# EasyEDA Pro project ProPrj_Crowd Guarddd_2026-06-03.epro

# Schematic Schematic1
Board Name: Board1; Create Date: 2026-06-02; Page Name: P1; Project Name: Crowd Guarddd; Schematic Name: Schematic1; Update Date: 2026-06-02; Company: EasyEDA.com; Page Size: A4; Version: V1.0
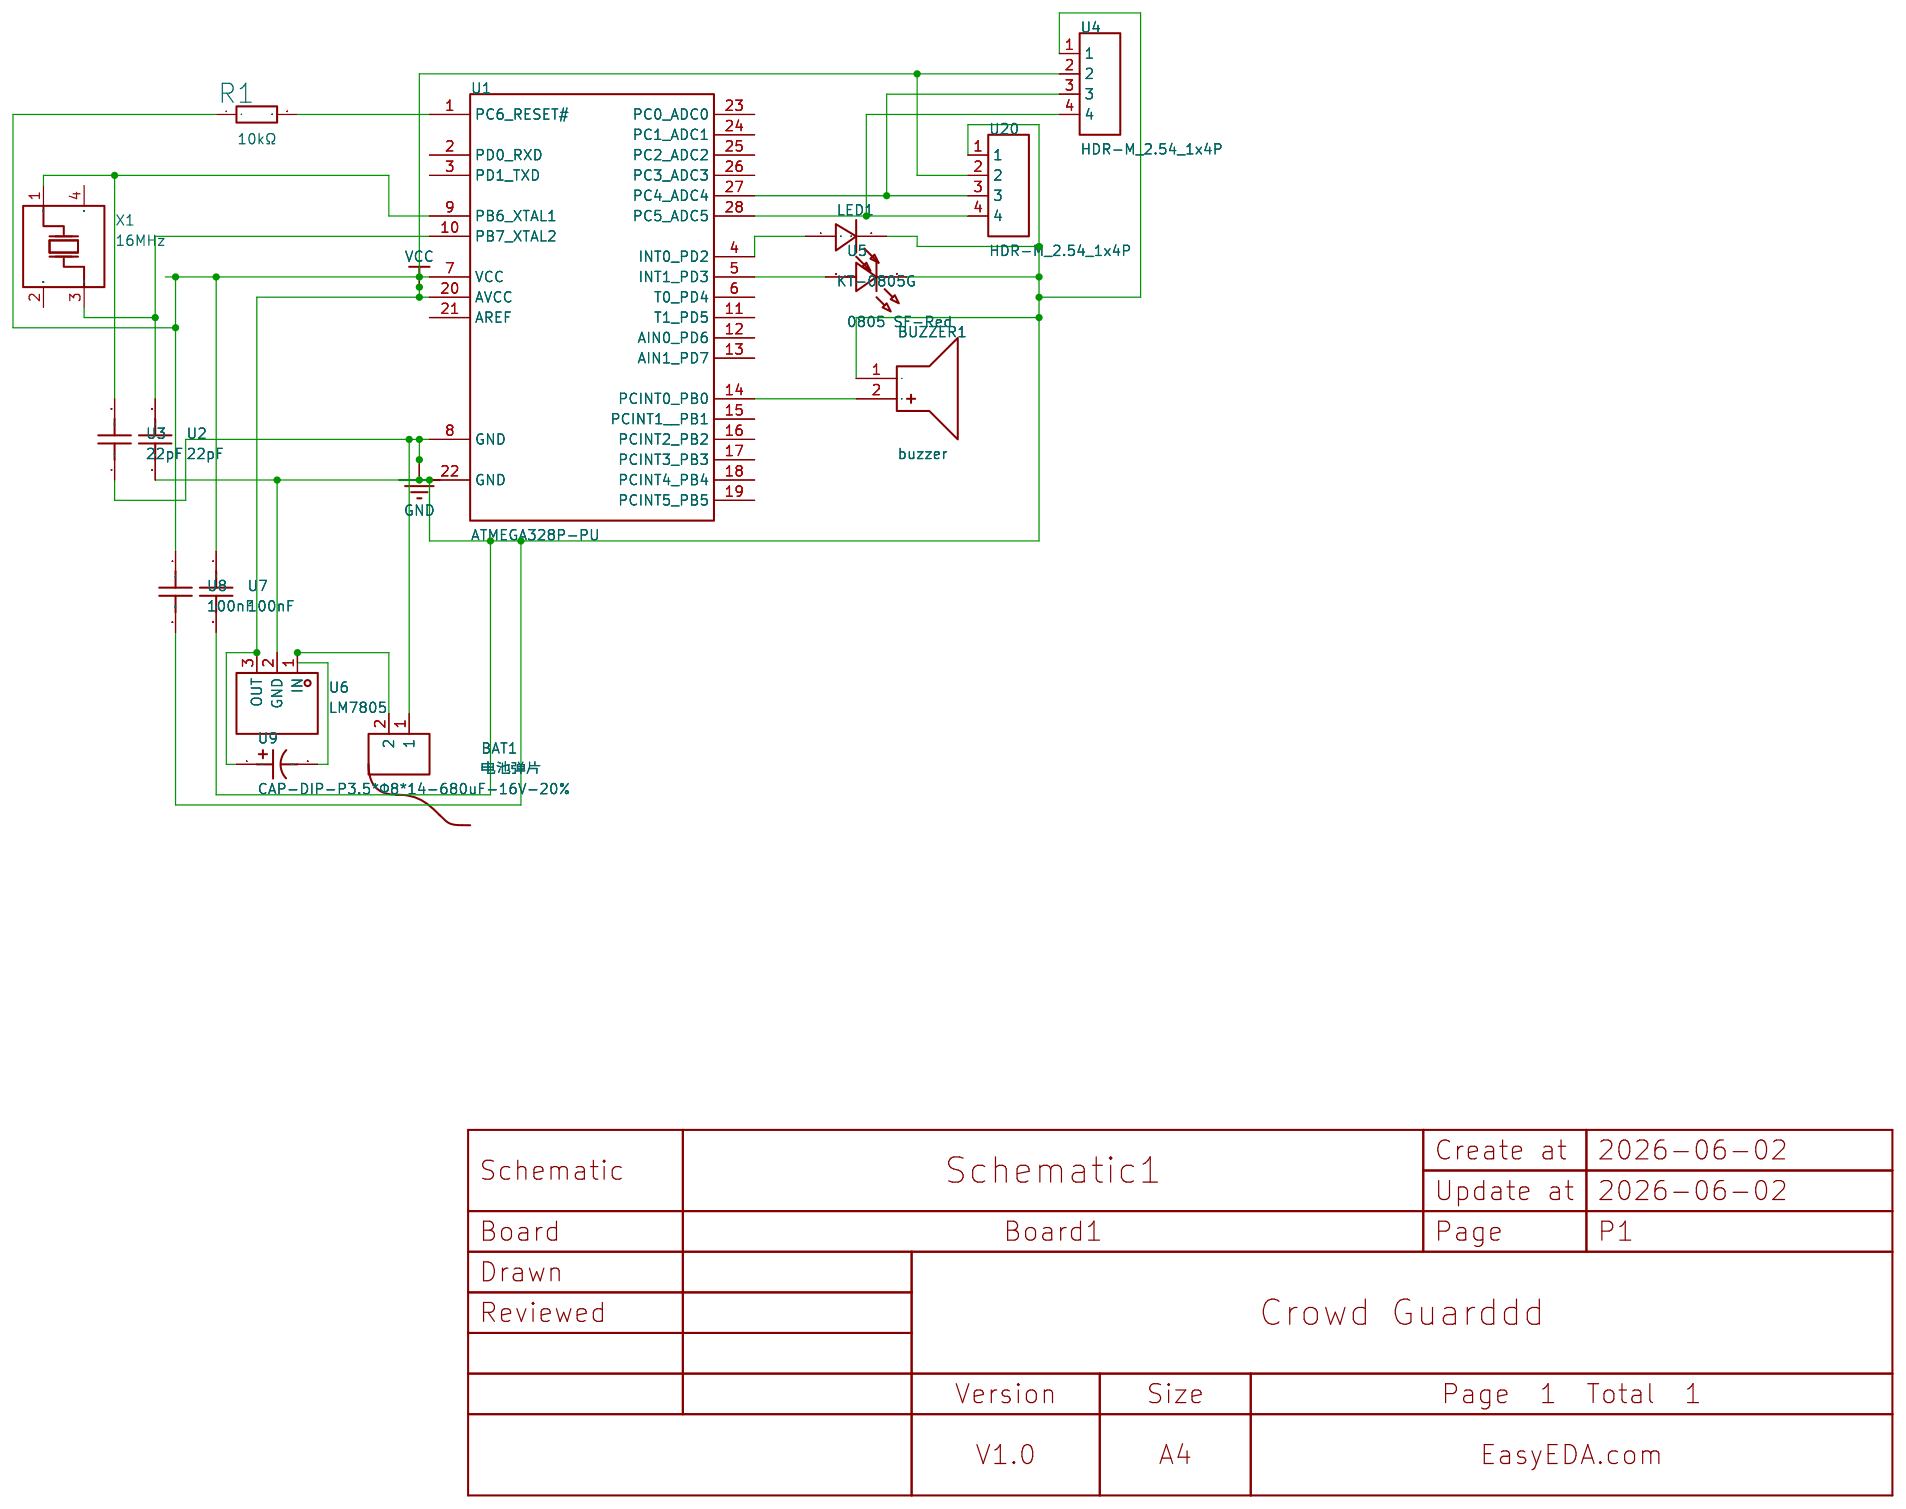
[diagram p0: schematic sheet]

## Parts
BAT1  电池弹片  [BAT-TH_L4.0-W3.0-P3.7]
BUZZER1  buzzer  [BUZ-TH_BD12.0-P6.00-D0.9-RD]
LED1  KT-0805G  [LED0805-R-RD]
R1  10kΩ  [R0603]
U1  ATMEGA328P-PU  [DIP-28_L34.6-W7.3-P2.54-LS10.2-BL]
U2  22pF  [C0805]
U3  22pF  [C0805]
U4  HDR-M_2.54_1x4P  [HDR-TH_HDR-M_2.54_1X4P]
U5  0805 SF-Red  [LED0805-RD_RED]
U6  LM7805  [TO-220-3_L10.0-W4.5-P2.54-L]
U7  100nF  [CAP-TH_L5.0-W2.5-P5.00-D1.0]
U8  100nF  [CAP-TH_L5.0-W2.5-P5.00-D1.0]
U9  CAP-DIP-P3.5*Φ8*14-680uF-16V-20%  [CAP-TH_BD8.0-P3.50-D0.5-FD]
U20  HDR-M_2.54_1x4P  [HDR-TH_HDR-M_2.54_1X4P]
X1  16MHz  [CRYSTAL-SMD_4P-L3.2-W2.5-BL]

## Library data of the parts
BAT1 = 电池弹片: Supplier Part: C9900020299; Supplier Footprint: BATTERY2; JLCPCB Part Class: Extended Part; Supplier: LCSC
BUZZER1 = buzzer: Supplier Part: C9900014030; JLCPCB Part Class: Extended Part; Supplier: LCSC
LED1 = KT-0805G: Lamp Holder Type:2mm x 1.25mm square LED Illumination Color:Emerald Green Voltage - Forward(Vf):2.6V~3.1V Voltage - Forward(Vf):2.6V~3.1V Power(Watts):100mW Forward Current:5mA Wavelength - Dominant:513nm~528nm Wavelength - Dominant:513nm~528nm Peak Wavel; LCSC Part Name: 0805 翠绿 高亮; Supplier Part: C2297; Manufacturer: KENTO; Supplier Footprint: 0805; JLCPCB Part Class: Basic Part; Datasheet: https://item.szlcsc.com/datasheet/KT-0805G/2670.html; Supplier: LCSC; Lamp Holder Type: 2mm x 1.25mm square LED; Illumination Color: Emerald Green; Voltage - Forward(Vf): 2.6V~3.1V; Power(Watts): 100mW; Forward Current: 5mA; Wavelength - Dominant: 513nm~528nm; Peak Wavelength: 525nm; Diode Configuration: Discrete Diode; Lens Color: Water Clear; Luminous Intensity: 430mcd; Viewing Angle: 120°; Operating Temperature: -40℃~+85℃
R1 = 0603WAF1002T5E: Type:Thick Film Resistor Resistance:10kΩ Tolerance:±1% Tolerance:±1% Power(Watts):100mW Voltage-Supply(Max):75V Temperature Coefficient:±100ppm/℃ Temperature Coefficient:±100ppm/℃ Operating Temperature:-55℃~+155℃ Operating Temperature:-55℃~+155℃; LCSC Part Name: 厚膜电阻 10kΩ ±1% 100mW; Supplier Part: C25804; Manufacturer: UNI-ROYAL(厚声); Supplier Footprint: 0603; JLCPCB Part Class: Basic Part; Datasheet: https://item.szlcsc.com/datasheet/0603WAF1002T5E/26547.html; Supplier: LCSC; Type: Thick Film Resistor; Tolerance: ±1%; Power(Watts): 100mW; Voltage-Supply(Max): 75V; Temperature Coefficient: ±100ppm/℃; Operating Temperature: -55℃~+155℃
U1 = ATMEGA328P-PU: CPU Core:AVR CPU Maximum Speed:20MHz Program Storage Size:32KB Program Memory Type:FLASH Number of I/O:23 ADC (Bit):10bit Voltage - Supply:1.8V~5.5V Voltage - Supply:1.8V~5.5V Applications:-; LCSC Part Name: MSL=1 基于AVR增强型RISC架构的低功耗CMOS 8位微控制器; Supplier Part: C33901; Manufacturer: MICROCHIP(美国微芯); Supplier Footprint: DIP-28-300mil; JLCPCB Part Class: Extended Part; Datasheet: https://item.szlcsc.com/datasheet/ATMEGA328P-PU/34869.html; Supplier: LCSC; CPU Core: AVR; CPU Maximum Speed: 20MHz; Program Storage Size: 32KB; Program Memory Type: FLASH; Number of I/O: 23; ADC (Bit): 10bit; Voltage - Supply: 1.8V~5.5V
U2 U3 = C0805C220J1GACTU: Capacitance:22pF Tolerance:±5% Tolerance:±5% Voltage Rating:100V Temperature Coefficient:C0G; LCSC Part Name: 22pF ±5% 100V; Supplier Part: C25113926; Manufacturer: KEMET(基美); Supplier Footprint: 0805; Datasheet: https://item.szlcsc.com/datasheet/C0805C220J1GACTU/26842802.html; Supplier: LCSC; Tolerance: ±5%; Voltage Rating: 100V; Temperature Coefficient: C0G
U4 U20 = HDR-M_2.54_1x4P_C9900236824: Supplier Part: C9900236824; Supplier Footprint: HDR-TH_4P-P2.54-V-M; JLCPCB Part Class: Extended Part; Supplier: LCSC
U5 = 0805 SF-Red: Supplier Part: C9900020303; Supplier Footprint: LED0805RD_RED; JLCPCB Part Class: Extended Part; Supplier: LCSC
U6 = LM7805_C845394: Output Type:Fixed Voltage - Supply:35V Output Voltage:5V Output Voltage:5V Output Current:- Power Supply Rejection Ratio (PSRR):73dB@(120Hz) Voltage Dropout:2V@(1A) standby current:5mA Noise:42uV Operating Temperature:0℃~+150℃@(Tj) Operating Temperature:0; Supplier Part: C845394; Manufacturer: TF(拓锋); Supplier Footprint: TO-220; JLCPCB Part Class: Extended Part; Datasheet: https://item.szlcsc.com/datasheet/LM7805/905247.html; Supplier: LCSC; Output Type: Fixed; Voltage - Supply: 35V; Output Voltage: 5V; Power Supply Rejection Ratio (PSRR): 73dB@(120Hz); Voltage Dropout: 2V@(1A); standby current: 5mA; Noise: 42uV; Operating Temperature: 0℃~+150℃@(Tj); Output Configuration: Positive; Number of Outputs: 1
U7 U8 = 100nF: Supplier Part: C9900015256; JLCPCB Part Class: Extended Part; Supplier: LCSC
U9 = CAP-DIP-P3.5*Φ8*14-680uF-16V-20%: Supplier Part: C9900006552; Supplier Footprint: CAP-DIP; JLCPCB Part Class: Extended Part; Supplier: LCSC
X1 = X322516MLB4SI: Type:Crystal Oscillator Frequency:16MHz Normal temperature Frequency Tolerance:±10ppm Normal temperature Frequency Tolerance:±10ppm Load Capacitance:9pF Frequency Stability:±20ppm Frequency Stability:±20ppm Operating Temperature:-40℃~+85℃ Operating Temper; LCSC Part Name: YSX321SL 16MHZ 4P 3225 9PF ±10PPM -40~85℃ (±20PPM); Supplier Part: C13738; Manufacturer: YXC(扬兴晶振); Supplier Footprint: SMD3225-4P; JLCPCB Part Class: Basic Part; Datasheet: https://item.szlcsc.com/datasheet/X322516MLB4SI/14393.html; Supplier: LCSC; Type: Crystal Oscillator; Normal temperature Frequency Tolerance: ±10ppm; Load Capacitance: 9pF; Frequency Stability: ±20ppm; Operating Temperature: -40℃~+85℃

## Nets
GND: BAT1.1 BUZZER1.1(-) LED1.2(K) U1.8(GND) U1.22(GND) U2.1 U3.1 U4.1 U5.1(K) U6.2(GND) U7.2 U8.2 U20.1
VCC: R1.1 U1.7(VCC) U1.20(AVCC) U4.2 U6.3(OUT) U7.1 U8.1 U9.1 U20.2
$1N1: U1.9(PB6 XTAL1) U3.2 X1.1(OSC1)
$1N2: U1.10(PB7 XTAL2) U2.2 X1.3(OSC2)
$1N5: R1.2 U1.1(PC6 RESET#)
$1N6: U1.27(PC4 ADC4) U4.3 U20.3
$1N7: U1.28(PC5 ADC5) U4.4 U20.4
$1N8: BUZZER1.2(+) U1.14(PCINT0 PB0)
$1N9: LED1.1(A) U1.4(INT0 PD2)
$1N10: U1.5(INT1 PD3) U5.2(A)
$1N11: BAT1.2 U6.1(IN) U9.2

Not connected (* = marked no-connect by the designer): U1 2(PD0 RXD) 3(PD1 TXD) 6(T0 PD4) 11(T1 PD5) 12(AIN0 PD6) 13(AIN1 PD7) 15(PCINT1  PB1) 16(PCINT2 PB2) 17(PCINT3 PB3) 18(PCINT4 PB4) 19(PCINT5 PB5) 21(AREF) 23(PC0 ADC0) 24(PC1 ADC1) 25(PC2 ADC2) 26(PC3 ADC3); X1 2(GND) 4(GND)

# Board PCB1
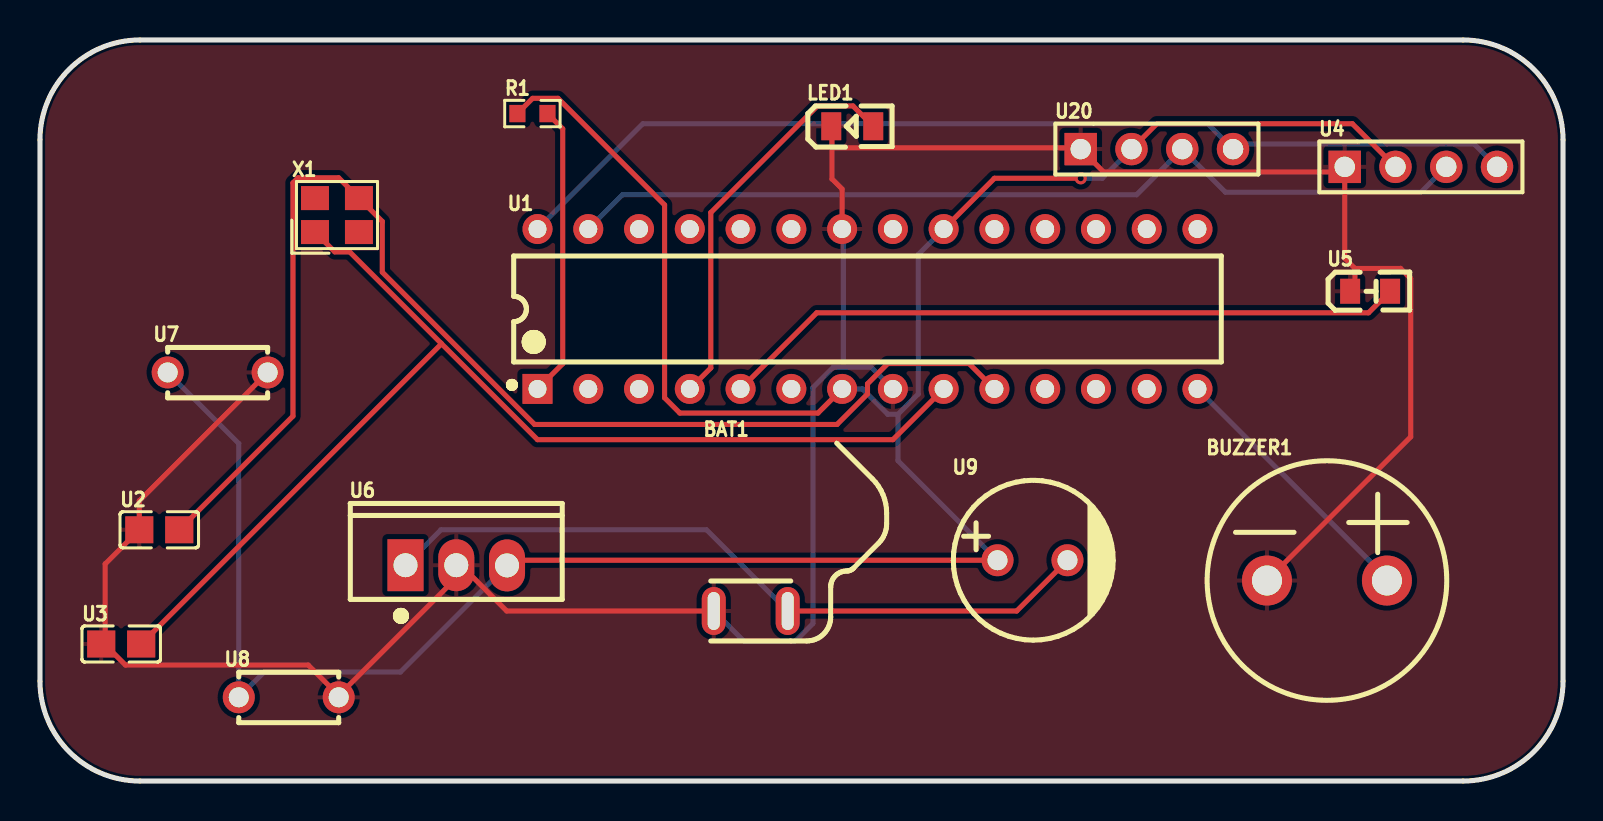
[diagram p1: board, top side]
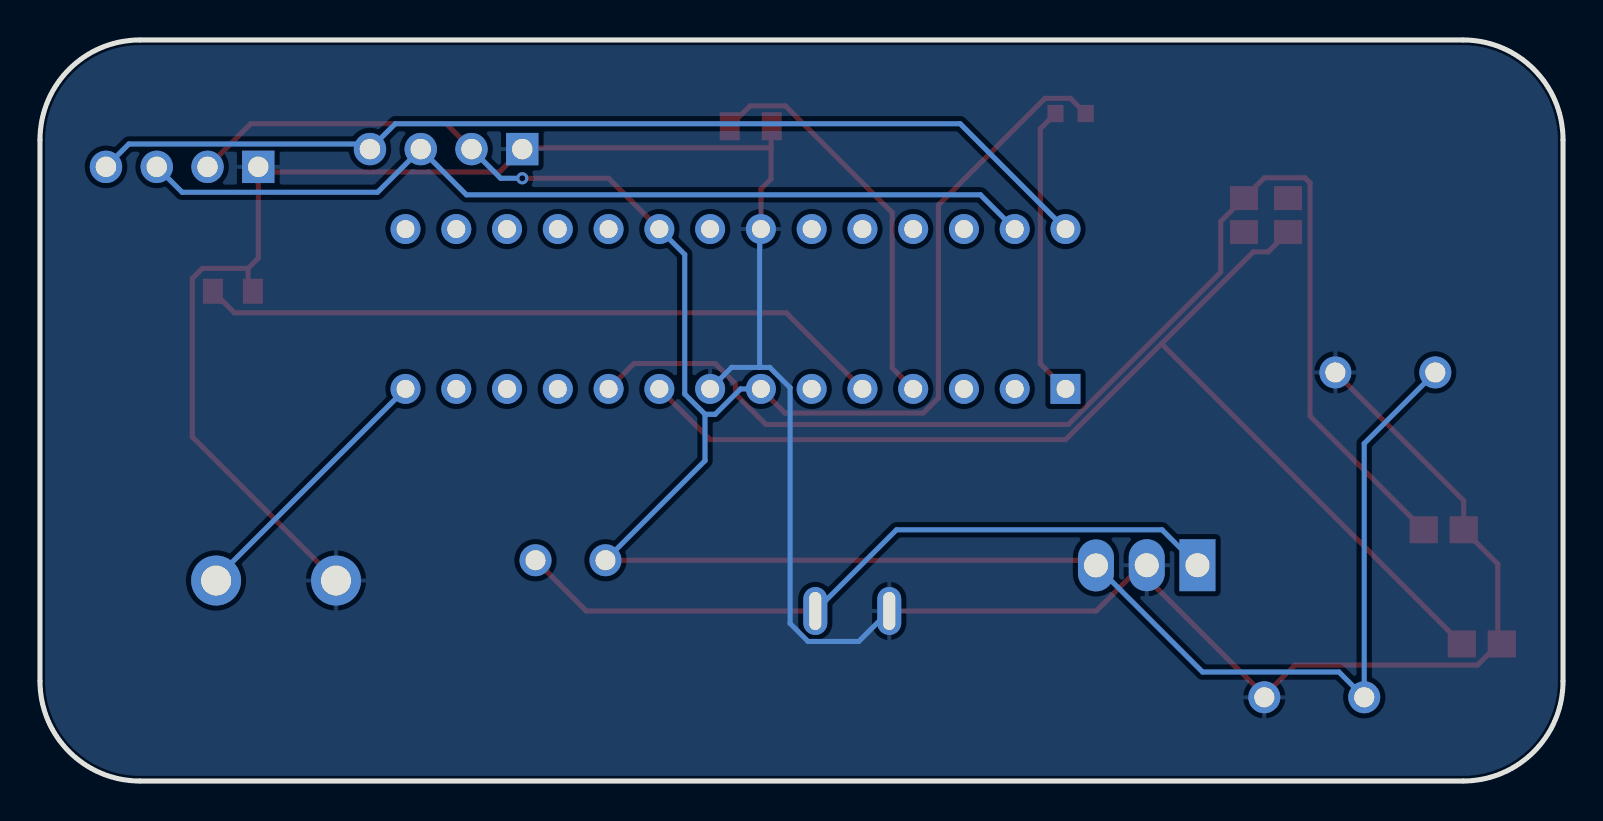
[diagram p2: board, bottom side, seen from below]

Outline 76.2 x 37.08 mm; copper layers: Top Layer, Bottom Layer. Coordinates in mm from the lower left corner of the outline.
Outline path: 0,32.08 0,5 arc(1.46,1.46) 5,0 71.2,0 arc(74.74,1.46) 76.2,5 76.2,32.08 arc(74.74,35.62) 71.2,37.08 5,37.08 arc(1.46,35.62) 0,32.08
Stack: Top Layer 0.035mm / Dielectric1 1.51mm FR4 er 4.5 / Bottom Layer 0.035mm

## Design rules (mm)
spacing copperThickness1oz (default): track to track 0.102, other pairs 0.152 to 0.3
spacing copperThickness2oz: track to track 0.203, other pairs 0.152 to 0.3
track width copperThickness1oz (default): min 0.127, default 0.254, max 2.54
track width copperThickness2oz: min 0.203, default 0.254, max 2.54
differential pair differentialPair (default): width min 0.127, default 0.254, max 2.54; gap min 0.152, default 0.152
net GND uses copperRegion

## Placement (name value [footprint] x y rotation side)
BAT1  电池弹片  [BAT-TH_L4.0-W3.0-P3.7]  35.56 8.51 0 top
BUZZER1  buzzer  [BUZ-TH_BD12.0-P6.00-D0.9-RD]  64.39 10.03 0 top
LED1  KT-0805G  [LED0805-R-RD]  40.64 32.77 0 top
R1  10kΩ  [R0603]  24.64 33.4 0 top
U1  ATMEGA328P-PU  [DIP-28_L34.6-W7.3-P2.54-LS10.2-BL]  41.4 23.62 0 top
U2  22pF  [C0805]  5.97 12.57 0 top
U3  22pF  [C0805]  4.06 6.86 0 top
U4  HDR-M_2.54_1x4P  [HDR-TH_HDR-M_2.54_1X4P]  69.09 30.73 0 top
U5  0805 SF-Red  [LED0805-RD_RED]  66.55 24.51 0 top
U6  LM7805  [TO-220-3_L10.0-W4.5-P2.54-L]  20.83 10.8 0 top
U7  100nF  [CAP-TH_L5.0-W2.5-P5.00-D1.0]  8.89 20.45 0 top
U8  100nF  [CAP-TH_L5.0-W2.5-P5.00-D1.0]  12.45 4.19 0 top
U9  CAP-DIP-P3.5*Φ8*14-680uF-16V-20%  [CAP-TH_BD8.0-P3.50-D0.5-FD]  49.66 11.05 0 top
U20  HDR-M_2.54_1x4P  [HDR-TH_HDR-M_2.54_1X4P]  55.88 31.62 0 top
X1  16MHz  [CRYSTAL-SMD_4P-L3.2-W2.5-BL]  14.86 28.32 0 top

## Footprints (pads in the part's own frame, mm; a bottom-side part is the same pattern mirrored in y, then rotated)
BAT-TH_L4.0-W3.0-P3.7
  oval 1.2x2.4 hole 0.6x1.9: 1(-1.85,0) 2(1.85,0)
BUZ-TH_BD12.0-P6.00-D0.9-RD
  round 2.5 hole 1.5: 1(-3,0) 2(3,0)
C0805
  rect 1.41x1.35 smd: 1(-1,0) 2(1,0)
CAP-TH_BD8.0-P3.50-D0.5-FD
  round 1.6 hole 1: 1(-1.75,0) 2(1.75,0)
CAP-TH_L5.0-W2.5-P5.00-D1.0
  round 1.6 hole 1: 1(-2.5,0) 2(2.5,0)
CRYSTAL-SMD_4P-L3.2-W2.5-BL
  rect 1.4x1.2 smd: 1(-1.1,-0.85) 2(1.1,-0.85) 3(1.1,0.85) 4(-1.1,0.85)
DIP-28_L34.6-W7.3-P2.54-LS10.2-BL
  rect 1.5x1.5 hole 0.9: 1(-16.51,-4)
  round 1.5 hole 0.9: 2(-13.97,-4) 3(-11.43,-4) 4(-8.89,-4) 5(-6.35,-4) 6(-3.81,-4) 7(-1.27,-4) 8(1.27,-4) 9(3.81,-4) 10(6.35,-4) 11(8.89,-4) 12(11.43,-4) 13(13.97,-4) 14(16.51,-4) 15(16.51,4) 16(13.97,4) 17(11.43,4) 18(8.89,4) 19(6.35,4) 20(3.81,4) 21(1.27,4) 22(-1.27,4) 23(-3.81,4) 24(-6.35,4) 25(-8.89,4) 26(-11.43,4) 27(-13.97,4) 28(-16.51,4)
HDR-TH_HDR-M_2.54_1X4P
  rect 1.62x1.62 hole 1.02: 1(-3.81,0)
  round 1.62 hole 1.02: 2(-1.27,0) 3(1.27,0) 4(3.81,0)
LED0805-R-RD
  rect 1x1.399 smd: 1(1.05,0) 2(-1.05,0)
LED0805-RD_RED
  rect 1x1.25 smd: 1(-1,0) 2(1,0)
R0603
  rect 0.806x0.864 smd: 1(-0.753,0) 2(0.753,0)
TO-220-3_L10.0-W4.5-P2.54-L
  rect 1.8x2.6 hole 1.2: 1(-2.54,0.005)
  oval 1.8x2.6 hole 1.2: 2(0,0.005) 3(2.54,-0.005)

## Nets
As in the schematic.

Pads without a net: U1 2 3 6 11 12 13 15 16 17 18 19 21 23 24 25 26; X1 2 4

## Via types
v1: diameter 0.61, hole 0.305, Top Layer to Bottom Layer, 1 via

## Routing (per net, layer and track width the routed paths; a pad name or vN(x,y) marks a point on that pad's centre or on a via; arc(x,y) is an arc through that point)
GND: length 141.6
  Top Layer w0.254: 14.95,4.28 13.42,5.8 4.28,5.8 3.26,6.82 ; 14.95,4.28 U8.2 ; 14.95,4.28 21.26,10.6 ; 3.26,6.82 U3.1 ; 3.26,6.82 3.26,10.87 U2.1 4.97,14.03 U7.2 ; 65.79,25.65 65.79,24.75 U5.1 ; 65.79,25.65 65.28,26.16 U4.1 65.02,30.48 53.21,30.48 U20.1 52.01,31.69 39.62,31.69 ; 65.79,25.65 68.07,25.65 68.58,25.15 68.58,17.22 BUZZER1.1 ; BAT1.1 23.35,8.51 21.26,10.6 ; 21.26,10.6 21.06,10.8 U6.2 ; LED1.2 39.62,32.73 39.62,31.69 ; 39.62,31.69 39.62,30.13 40.13,29.62 U1.22
  Bottom Layer w0.254: U1.22 40.19,27.56 40.19,20.7 ; U1.8 41.59,20.7 40.19,20.7 ; 40.19,20.7 39.69,20.7 38.67,19.69 38.67,7.88 37.77,6.98 35.23,6.98 BAT1.1
VCC: length 136.4
  Top Layer w0.254: U4.2 65.66,32.89 55.88,32.89 U20.2 ; U9.1 23.63,11.05 U6.3 ; U1.20 47.75,30.16 v1(52.07,30.16) ; U1.7 38.92,18.42 32.01,18.42 31.25,19.18 31.25,28.83 25.92,34.16 24.65,34.16 R1.1
  Bottom Layer w0.254: U20.2 53.15,30.16 v1(52.07,30.16) ; U6.3 18.03,5.46 11.21,5.46 U8.1 9.95,16.89 U7.1 ; 42.93,18.35 42.42,18.35 41.15,19.62 U1.7 ; 42.93,18.35 42.93,16.03 U9.1 ; 42.93,18.35 43.94,19.37 43.94,26.35 U1.20
$1N1: length 58.1
  Top Layer w0.254: X1.1 14.75,26.48 15.49,26.48 20.07,21.91 ; U1.9 42.67,17.08 24.89,17.08 20.07,21.91 ; 20.07,21.91 20.07,21.86 U3.2
$1N2: length 63.6
  Top Layer w0.254: U2.2 12.66,18.26 12.66,29.93 12.91,30.19 14.94,30.19 X1.3 17.13,28 17.13,25.46 24.75,17.84 39.88,17.84 41.4,19.37 41.4,19.88 42.42,20.89 46.48,20.89 U1.10
$1N5: length 14.6
  Top Layer w0.254: R1.2 26.15,32.64 26.15,20.88 U1.1
$1N6: length 46
  Bottom Layer w0.254: U1.27 29.15,29.34 54.86,29.34 U20.3 59.31,29.46 69.09,29.46 U4.3
$1N7: length 51.3
  Bottom Layer w0.254: U1.28 30.16,32.89 58.42,32.89 U20.4 59.94,31.88 71.75,31.88 U4.4
$1N8: length 13.5
  Bottom Layer w0.254: BUZZER1.2 67.39,10.15 U1.14
$1N9: length 20
  Top Layer w0.254: LED1.1 40.67,33.78 38.9,33.78 33.56,28.45 33.56,20.67 U1.4
$1N10: length 34.5
  Top Layer w0.254: U1.5 38.86,23.43 66.47,23.43 U5.2
$1N11: length 36.6
  Top Layer w0.254: BAT1.2 48.87,8.51 U9.2
  Bottom Layer w0.254: U6.1 20.06,12.57 33.35,12.57 BAT1.2

## Copper pours and planes (outline as drawn; the poured copper is in the pictures)
GND on Top Layer: -0.25,37.21 76.96,37.21 76.96,-0.38 -0.25,-0.38
GND on Bottom Layer: -0.89,37.59 76.84,37.59 76.84,-0.25 -0.89,-0.25
